# Altium schematic sheet KUBODriver_MCU.SchDoc
size 840 x 594 mm; DocumentNumber: BSV.23-KUBODRIVER Э3; SheetNumber: 4; Format: A1
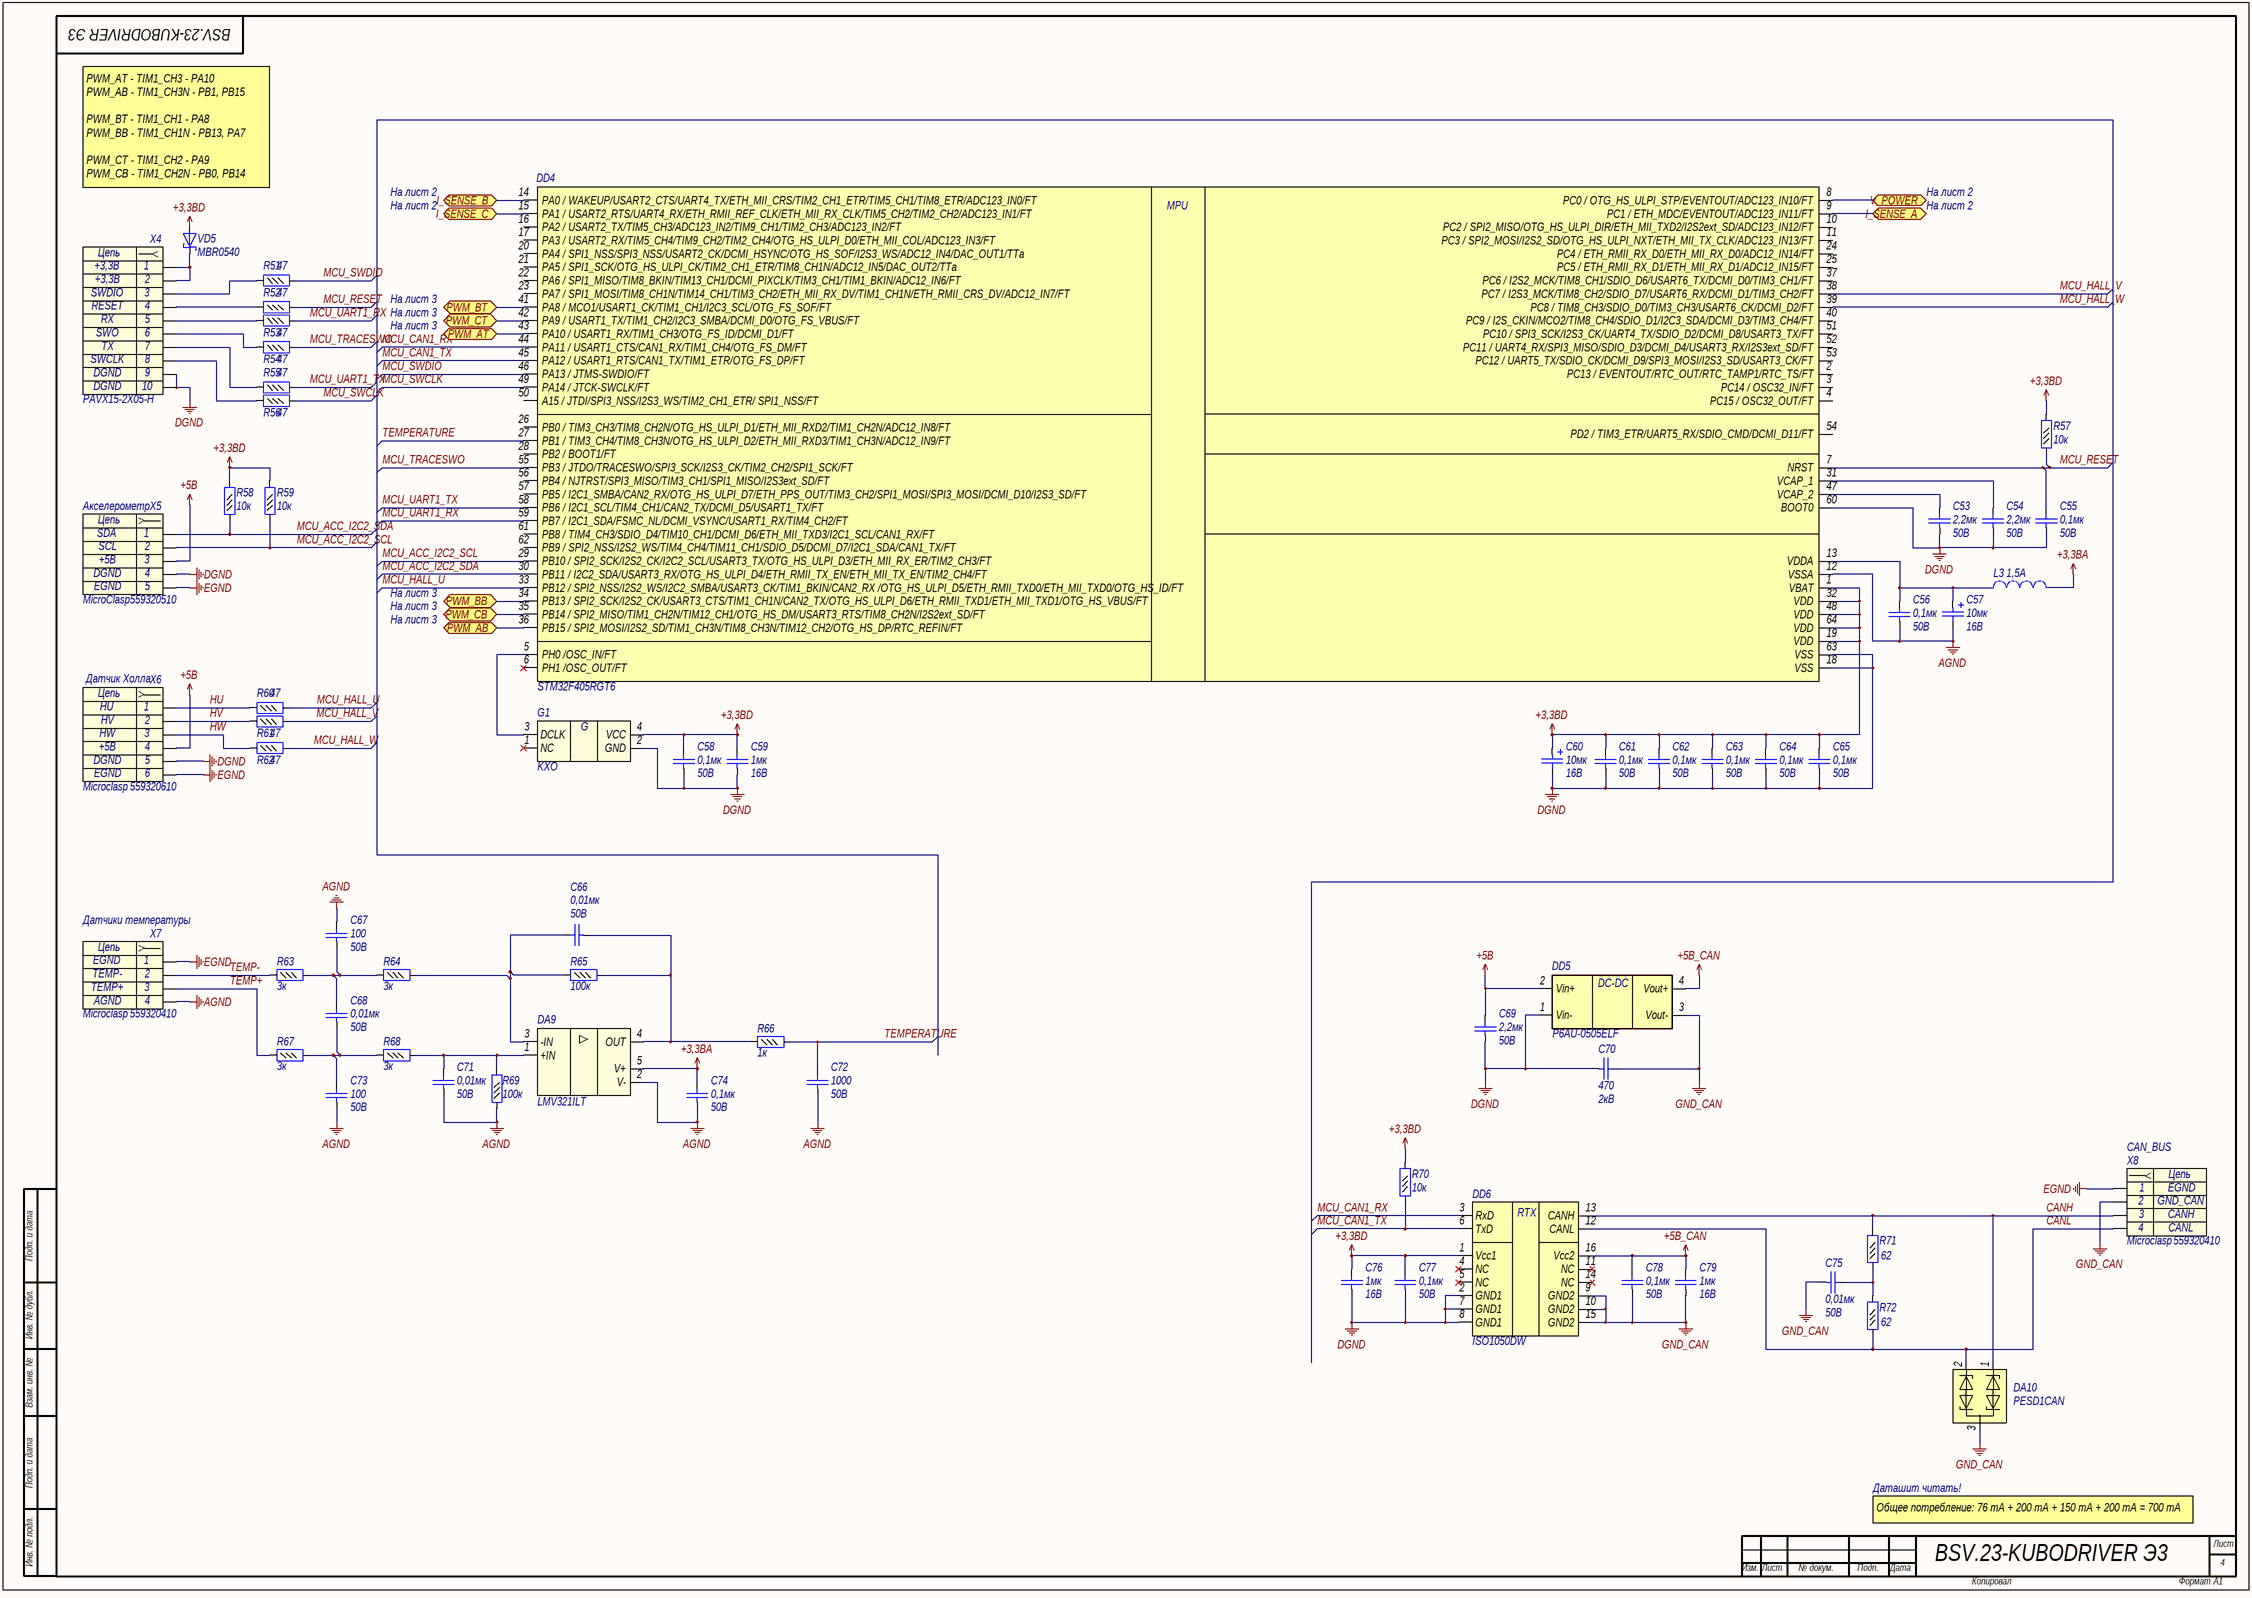
[diagram p0: KUBODriver_MCU.SchDoc]

## Parts
C53  value 2,2мк  Voltage: 50B  [C0603]  (hidden comment: Capacitor)
C54  value 2,2мк  Voltage: 50B  [C0603]  (hidden comment: Capacitor)
C55  value 0,1мк  Voltage: 50В  [C0402]  (hidden comment: Capacitor)
C56  value 0,1мк  Voltage: 50В  [C0402]  (hidden comment: Capacitor)
C57  value 10мк  Voltage: 16В  [TANTAL CASE A]  (hidden comment: Capacitor_pol)
C58  value 0,1мк  Voltage: 50В  [C0402]  (hidden comment: Capacitor)
C59  value 1мк  Voltage: 16B  [C0603]  (hidden comment: Capacitor)
C60  value 10мк  Voltage: 16В  [TANTAL CASE A]  (hidden comment: Capacitor_pol)
C61  value 0,1мк  Voltage: 50В  [C0402]  (hidden comment: Capacitor)
C62  value 0,1мк  Voltage: 50В  [C0402]  (hidden comment: Capacitor)
C63  value 0,1мк  Voltage: 50В  [C0402]  (hidden comment: Capacitor)
C64  value 0,1мк  Voltage: 50В  [C0402]  (hidden comment: Capacitor)
C65  value 0,1мк  Voltage: 50В  [C0402]  (hidden comment: Capacitor)
C66  value 0,01мк  Voltage: 50B  [C0402]  (hidden comment: Capacitor)
C67  value 100  Voltage: 50B  [C0402]  (hidden comment: Capacitor)
C68  value 0,01мк  Voltage: 50B  [C0402]  (hidden comment: Capacitor)
C69  value 2,2мк  Voltage: 50B  [C0603]  (hidden comment: Capacitor)
C70  value 470  Voltage: 2кВ  [C1206]  (hidden comment: Capacitor)
C71  value 0,01мк  Voltage: 50B  [C0402]  (hidden comment: Capacitor)
C72  value 1000  Voltage: 50B  [C0402]  (hidden comment: Capacitor)
C73  value 100  Voltage: 50B  [C0402]  (hidden comment: Capacitor)
C74  value 0,1мк  Voltage: 50В  [C0402]  (hidden comment: Capacitor)
C75  value 0,01мк  Voltage: 50B  [C0402]  (hidden comment: Capacitor)
C76  value 1мк  Voltage: 16B  [C0603]  (hidden comment: Capacitor)
C77  value 0,1мк  Voltage: 50В  [C0402]  (hidden comment: Capacitor)
C78  value 0,1мк  Voltage: 50В  [C0402]  (hidden comment: Capacitor)
C79  value 1мк  Voltage: 16B  [C0603]  (hidden comment: Capacitor)
DA9  LMV321ILT  [SOT23-5]
DA10  Part Number: PESD1CAN  [SOT23-3]  (hidden comment: PESD)
DD4  STM32F405RGT6  [LQFP64]
DD5  Part Number: P6AU-0505ELF  [SIP4]  (hidden comment: P6AU-xxxxELF)
DD6  (no value)  [SO16]
G1  KXO  [QSMD7x5.2x1.8]
L3  Rated Current: 1,5A  [L0603]  (hidden comment: Inductor)
R51  value 47  [R0402]  (hidden comment: Resistor_0,062Вт)
R52  value 47  [R0402]  (hidden comment: Resistor_0,062Вт)
R53  value 47  [R0402]  (hidden comment: Resistor_0,062Вт)
R54  value 47  [R0402]  (hidden comment: Resistor_0,062Вт)
R55  value 47  [R0402]  (hidden comment: Resistor_0,062Вт)
R56  value 47  [R0402]  (hidden comment: Resistor_0,062Вт)
R57  value 10к  [R0402]  (hidden comment: Resistor_0,062Вт)
R58  value 10к  [R0402]  (hidden comment: Resistor_0,062Вт)
R59  value 10к  [R0402]  (hidden comment: Resistor_0,062Вт)
R60  value 47  [R0402]  (hidden comment: Resistor_0,062Вт)
R61  value 47  [R0402]  (hidden comment: Resistor_0,062Вт)
R62  value 47  [R0402]  (hidden comment: Resistor_0,062Вт)
R63  value 3к  [R0402]  (hidden comment: Resistor_0,062Вт)
R64  value 3к  [R0402]  (hidden comment: Resistor_0,062Вт)
R65  value 100к  [R0402]  (hidden comment: Resistor_0,062Вт)
R66  value 1к  [R0402]  (hidden comment: Resistor_0,062Вт)
R67  value 3к  [R0402]  (hidden comment: Resistor_0,062Вт)
R68  value 3к  [R0402]  (hidden comment: Resistor_0,062Вт)
R69  value 100к  [R0402]  (hidden comment: Resistor_0,062Вт)
R70  value 10к  [R0402]  (hidden comment: Resistor_0,062Вт)
R71  value 62  [R0402]  (hidden comment: Resistor_0,062Вт)
R72  value 62  [R0402]  (hidden comment: Resistor_0,062Вт)
VD5  Part Number: MBR0540  [SOD-123]  (hidden comment: DiodeSchottky)
X4  Header_10_sct  [PAVX15-2X05-H]  (value not drawn)
X5  Акселерометр  Part Name: MicroClasp  Part Number: 559320510  [MOLEX_559320510]
X6  Датчик Холла  Part Number: 559320610  [MOLEX_559320610]
X7  Датчики температуры  Part Number: 559320410  [MOLEX_559320410]
X8  CAN_BUS  Part Number: 559320410  [MOLEX_559320410]

## Ports
I_SENSE_A, I_SENSE_B, I_SENSE_C, PWM_AB, PWM_AT, PWM_BB, PWM_BT, PWM_CB, PWM_CT, V_POWER

## Nets
+3,3BA: C74.2 DA9.5(V+) L3.2
+3,3BD: C58.2 C59.2 C60.1 C61.2 C62.2 C63.2 C64.2 C65.2 C76.2 C77.2 DD4.1(VBAT) DD4.19(VDD) DD4.32(VDD) DD4.48(VDD) DD4.64(VDD) DD6.1(Vcc1) G1.4(VCC) R57.2 R58.2 R59.2 R70.2 VD5.2(A)
+5B: C69.2 DD5.2(Vin+) X5.3 X6.4
+5B_CAN: C78.2 C79.2 DD5.4(Vout+) DD6.16(Vcc2)
AGND: C56.1 C57.2 C67.2 C71.1 C72.1 C73.1 C74.1 DA9.2(V-) DD4.12(VSSA) R69.1 X7.4
DGND: C53.1 C54.1 C55.1 C58.1 C59.1 C60.2 C61.1 C62.1 C63.1 C64.1 C65.1 C69.1 C70.1 C76.1 C77.1 DD4.18(VSS) DD4.60(BOOT0) DD4.63(VSS) DD5.1(Vin-) DD6.2(GND1) DD6.7(GND1) DD6.8(GND1) G1.2(GND) X4.9 X4.10 X5.4 X6.5
EGND: X5.5 X6.6 X7.1 X8.1
GND_CAN: C70.2 C75.1 C78.1 C79.1 DA10.3 DD5.3(Vout-) DD6.9(GND2) DD6.10(GND2) DD6.15(GND2) X8.2
CANH: DA10.1 DD6.13(CANH) R71.2 X8.3
CANL: DA10.2 DD6.12(CANL) R72.1 X8.4
HU: R60.1 X6.1
HV: R61.1 X6.2
HW: R62.1 X6.3
I_SENSE_A: DD4.9(PC1_/_ETH_MDC/EVENTOUT/ADC123_IN11/FT) ; port I_SENSE_A
I_SENSE_B: DD4.14(PA0_/_WAKEUP/USART2_CTS/UART4_TX/ETH_MII_CRS/TIM2_CH1_ETR/TIM5_CH1/TIM8_ETR/ADC123_IN0/FT) ; port I_SENSE_B
I_SENSE_C: DD4.15(PA1_/_USART2_RTS/UART4_RX/ETH_RMII_REF_CLK/ETH_MII_RX_CLK/TIM5_CH2/TIM2_CH2/ADC123_IN1/FT) ; port I_SENSE_C
MCU_ACC_I2C2_SCL: DD4.29(PB10_/_SPI2_SCK/I2S2_CK/I2C2_SCL/USART3_TX/OTG_HS_ULPI_D3/ETH_MII_RX_ER/TIM2_CH3/FT) R59.1 X5.2
MCU_ACC_I2C2_SDA: DD4.30(PB11_/_I2C2_SDA/USART3_RX/OTG_HS_ULPI_D4/ETH_RMII_TX_EN/ETH_MII_TX_EN/TIM2_CH4/FT) R58.1 X5.1
MCU_CAN1_RX: DD4.44(PA11_/_USART1_CTS/CAN1_RX/TIM1_CH4/OTG_FS_DM/FT) DD6.3(RxD)
MCU_CAN1_TX: DD4.45(PA12_/_USART1_RTS/CAN1_TX/TIM1_ETR/OTG_FS_DP/FT) DD6.6(TxD) R70.1
MCU_HALL_U: DD4.33(PB12_/_SPI2_NSS/I2S2_WS/I2C2_SMBA/USART3_CK/TIM1_BKIN/CAN2_RX_/OTG_HS_ULPI_D5/ETH_RMII_TXD0/ETH_MII_TXD0/OTG_HS_ID/FT) R60.2
MCU_HALL_V: DD4.38(PC7_/_I2S3_MCK/TIM8_CH2/SDIO_D7/USART6_RX/DCMI_D1/TIM3_CH2/FT) R61.2
MCU_HALL_W: DD4.39(PC8_/_TIM8_CH3/SDIO_D0/TIM3_CH3/USART6_CK/DCMI_D2/FT) R62.2
MCU_RESET: C55.2 DD4.7(NRST) R52.2 R57.1
MCU_SWCLK: DD4.49(PA14_/_JTCK-SWCLK/FT) R56.2
MCU_SWDIO: DD4.46(PA13_/_JTMS-SWDIO/FT) R51.2
MCU_TRACESWO: DD4.55(PB3_/_JTDO/TRACESWO/SPI3_SCK/I2S3_CK/TIM2_CH2/SPI1_SCK/FT) R54.2
MCU_UART1_RX: DD4.59(PB7_/_I2C1_SDA/FSMC_NL/DCMI_VSYNC/USART1_RX/TIM4_CH2/FT) R53.2
MCU_UART1_TX: DD4.58(PB6_/_I2C1_SCL/TIM4_CH1/CAN2_TX/DCMI_D5/USART1_TX/FT) R55.2
PWM_AB: DD4.36(PB15_/_SPI2_MOSI/I2S2_SD/TIM1_CH3N/TIM8_CH3N/TIM12_CH2/OTG_HS_DP/RTC_REFIN/FT) ; port PWM_AB
PWM_AT: DD4.43(PA10_/_USART1_RX/TIM1_CH3/OTG_FS_ID/DCMI_D1/FT) ; port PWM_AT
PWM_BB: DD4.34(PB13_/_SPI2_SCK/I2S2_CK/USART3_CTS/TIM1_CH1N/CAN2_TX/OTG_HS_ULPI_D6/ETH_RMII_TXD1/ETH_MII_TXD1/OTG_HS_VBUS/FT) ; port PWM_BB
PWM_BT: DD4.41(PA8_/_MCO1/USART1_CK/TIM1_CH1/I2C3_SCL/OTG_FS_SOF/FT) ; port PWM_BT
PWM_CB: DD4.35(PB14_/_SPI2_MISO/TIM1_CH2N/TIM12_CH1/OTG_HS_DM/USART3_RTS/TIM8_CH2N/I2S2ext_SD/FT) ; port PWM_CB
PWM_CT: DD4.42(PA9_/_USART1_TX/TIM1_CH2/I2C3_SMBA/DCMI_D0/OTG_FS_VBUS/FT) ; port PWM_CT
TEMP+: R67.1 X7.3
TEMP-: R63.1 X7.2
TEMPERATURE: C72.2 DD4.27(PB1_/_TIM3_CH4/TIM8_CH3N/OTG_HS_ULPI_D2/ETH_MII_RXD3/TIM1_CH3N/ADC12_IN9/FT) R66.2
V_POWER: DD4.8(PC0_/_OTG_HS_ULPI_STP/EVENTOUT/ADC123_IN10/FT) ; port V_POWER
NetC53_2: C53.2 DD4.47(VCAP_2)
NetC54_2: C54.2 DD4.31(VCAP_1)
NetC56_2: C56.2 C57.1 DD4.13(VDDA) L3.1
NetC66_1: C66.1 DA9.4(OUT) R65.2 R66.1
NetC66_2: C66.2 DA9.3(-IN) R64.2 R65.1
NetC67_1: C67.1 C68.2 R63.2 R64.1
NetC68_1: C68.1 C73.2 R67.2 R68.1
NetC71_2: C71.2 DA9.1(+IN) R68.2 R69.2
NetC75_2: C75.2 R71.1 R72.2
NetDD4_5: DD4.5(PH0_/OSC_IN/FT) G1.3(DCLK)
NetR51_1: R51.1 X4.3
NetR52_1: R52.1 X4.4
NetR53_1: R53.1 X4.5
NetR54_1: R54.1 X4.6
NetR55_1: R55.1 X4.7
NetR56_1: R56.1 X4.8
NetVD5_1: VD5.1(K) X4.1 X4.2

Not connected (* = marked no-connect by the designer): DD4 2(PC13_/_EVENTOUT/RTC_OUT/RTC_TAMP1/RTC_TS/FT) 3(PC14_/_OSC32_IN/FT) 4(PC15_/_OSC32_OUT/FT) 6(PH1_/OSC_OUT/FT)* 10(PC2_/_SPI2_MISO/OTG_HS_ULPI_DIR/ETH_MII_TXD2/I2S2ext_SD/ADC123_IN12/FT) 11(PC3_/_SPI2_MOSI/I2S2_SD/OTG_HS_ULPI_NXT/ETH_MII_TX_CLK/ADC123_IN13/FT) 16(PA2_/_USART2_TX/TIM5_CH3/ADC123_IN2/TIM9_CH1/TIM2_CH3/ADC123_IN2/FT) 17(PA3_/_USART2_RX/TIM5_CH4/TIM9_CH2/TIM2_CH4/OTG_HS_ULPI_D0/ETH_MII_COL/ADC123_IN3/FT) 20(PA4_/_SPI1_NSS/SPI3_NSS/USART2_CK/DCMI_HSYNC/OTG_HS_SOF/I2S3_WS/ADC12_IN4/DAC_OUT1/TTa) 21(PA5_/_SPI1_SCK/OTG_HS_ULPI_CK/TIM2_CH1_ETR/TIM8_CH1N/ADC12_IN5/DAC_OUT2/TTa) 22(PA6_/_SPI1_MISO/TIM8_BKIN/TIM13_CH1/DCMI_PIXCLK/TIM3_CH1/TIM1_BKIN/ADC12_IN6/FT) 23(PA7_/_SPI1_MOSI/TIM8_CH1N/TIM14_CH1/TIM3_CH2/ETH_MII_RX_DV/TIM1_CH1N/ETH_RMII_CRS_DV/ADC12_IN7/FT) 24(PC4_/_ETH_RMII_RX_D0/ETH_MII_RX_D0/ADC12_IN14/FT) 25(PC5_/_ETH_RMII_RX_D1/ETH_MII_RX_D1/ADC12_IN15/FT) 26(PB0_/_TIM3_CH3/TIM8_CH2N/OTG_HS_ULPI_D1/ETH_MII_RXD2/TIM1_CH2N/ADC12_IN8/FT) 28(PB2_/_BOOT1/FT) 37(PC6_/_I2S2_MCK/TIM8_CH1/SDIO_D6/USART6_TX/DCMI_D0/TIM3_CH1/FT) 40(PC9_/_I2S_CKIN/MCO2/TIM8_CH4/SDIO_D1/I2C3_SDA/DCMI_D3/TIM3_CH4/FT) 50(A15_/_JTDI/SPI3_NSS/I2S3_WS/TIM2_CH1_ETR/_SPI1_NSS/FT) 51(PC10_/_SPI3_SCK/I2S3_CK/UART4_TX/SDIO_D2/DCMI_D8/USART3_TX/FT) 52(PC11_/_UART4_RX/SPI3_MISO/SDIO_D3/DCMI_D4/USART3_RX/I2S3ext_SD/FT) 53(PC12_/_UART5_TX/SDIO_CK/DCMI_D9/SPI3_MOSI/I2S3_SD/USART3_CK/FT) 54(PD2_/_TIM3_ETR/UART5_RX/SDIO_CMD/DCMI_D11/FT) 56(PB4_/_NJTRST/SPI3_MISO/TIM3_CH1/SPI1_MISO/I2S3ext_SD/FT) 57(PB5_/_I2C1_SMBA/CAN2_RX/OTG_HS_ULPI_D7/ETH_PPS_OUT/TIM3_CH2/SPI1_MOSI/SPI3_MOSI/DCMI_D10/I2S3_SD/FT) 61(PB8_/_TIM4_CH3/SDIO_D4/TIM10_CH1/DCMI_D6/ETH_MII_TXD3/I2C1_SCL/CAN1_RX/FT) 62(PB9_/_SPI2_NSS/I2S2_WS/TIM4_CH4/TIM11_CH1/SDIO_D5/DCMI_D7/I2C1_SDA/CAN1_TX/FT); DD6 4(NC)* 5(NC)* 11(NC)* 14(NC)*; G1 1(NC)*

## Notes on the sheet
- PWM_AT - TIM1_CH3 - PA10
  PWM_AB - TIM1_CH3N - PB1, PB15
  PWM_BT - TIM1_CH1 - PA8
  PWM_BB - TIM1_CH1N - PB13, PA7
  PWM_CT - TIM1_CH2 - PA9
  PWM_CB - TIM1_CH2N - PB0, PB14
- На лист 2
- На лист 3
- (near X6) Microclasp
- (near X7) Microclasp
- Подп. и дата
- (near X8) Microclasp
- Инв. № дубл.
- Взам. инв. №
- Даташит читать!
- Общее потребление: 76 mA + 200 mA + 150 mA + 200 mA = 700 mA
- Инв. № подл.
- Лист
- Изм.
- № докум.
- Подп.
- Дата
- Копировал
- Формат
- (in symbol connect97) Цепь
- (in symbol connect98) Цепь
- (in symbol connect99) Цепь
- (in symbol connect107) Цепь
- (in symbol crystal10) G
- (in symbol interf22) RTX
- (in symbol microcont10) MPU
- (in symbol pwr52) DC-DC

## Library data of the parts
C53 C54 C69 = cap134: Конденсатор; Part Name: Ceramic; Manufacture: Murata; Part Number: GRM188R71A225KE15D; id: cap134; TKE: X7R
C55 C56 C58 C61-C65 C74 C77 C78 = cap277: Конденсатор; Part Name: Ceramic; Manufacture: Murata; Part Number: GRM155R71H104KE14D; id: cap277; TKE: X7R; tga: 0,10%
C57 C60 = cap199: Конденсатор полярный; Part Name: Tantal; Manufacture: Vishay; Part Number: 293D106X9016A2TE3; id: cap199
C59 C76 C79 = cap133: Конденсатор; Part Name: Ceramic; Manufacture: Murata; Part Number: GRM188R71C105KA12D**; id: cap133; TKE: X7R
C66 C68 C71 C75 = cap42: Конденсатор; Part Name: Ceramic; Manufacture: Murata; Part Number: GRM155R71H103K; id: cap42; TKE: X7R
C67 C73 = cap29: Конденсатор; Part Name: Ceramic; Manufacture: Murata; Part Number: GRM1535C1H101J; id: cap29; TKE: NP0
C70 = cap284: Конденсатор; Part Name: Ceramic; Manufacture: Yageo; Part Number: CC1206KKX7RDBB471; id: cap284; TKE: X7R
C72 = cap28: Конденсатор; Part Name: Ceramic; Manufacture: Murata; Part Number: GRM1555C1H102J; id: cap28; TKE: NP0
DA9 = amp10: HIGH-DRIVE OPERATIONAL AMPLIFIERS WITH SHUTDOWN; Part Name: Micropower / Operational Amplifiers; Manufacture: ST Microelectronics; id: amp10; Rail-to-rail: yes; Supply Voltage: 2,7-6B; Supply Current max: 200uA; Bandwidth: 1MHz; Input Bias Current: 10nA; CMRR: 85dB; PSRR: 80dB; Offset voltage: 0,1mB; Channels: 1; Part Number: LMV321ILT
DA10 = PESD1CAN: TVS; Part Name: CAN bus ESD protection diode; Manufacture: Nexperia; id: esd5; Max Reverse Voltage: 24B; Breakdown Voltage: 25,4B; Capacitance: 17pF; Number of Channels: 2
DD4 = microcont10: Part Name: Microcontroller; Frequency: 168MHz; ADC: 16x12b/2x12b; Interface: can, i2c, irda, lin, spi, uart, usbotg,sdio; Flash: 1Mb; Pin in: 51; Power Supply: 1.8-3.6V; id: microcont10; Part Number: STM32F405RGT6
DD5 = pwr52: DC/DC преобразователь; Part Name: DC/DC Converter Isolated; Manufacturer: PEAK Electronics; id: pwr52; Input Voltage: 5B; Current: 200mA; Type: Isolated; Output Voltage: 5B
DD6 = interf22: Isolated CAN Transceiver; Manufacture: Texas Instruments; Number of Channel: 1; Type Supply: Single Polar; Current Consumption: 76mA; Power Supply: 3-5,5В/4,75-5,25В; id: interf22; Part Name: Isolated CAN Transceiver; Part Number: ISO1050DW
G1 = crystal10: Кварц. генер. 32.768 МГц (HCMOS/TTL); Manufacture: GEYER; Part Number: KXO-V97; Frequence: 12MHz; id: crystal10
L3 = ind0: EMI Suppression Filter; Part Name: EMI Suppression Filters; Part Number: BLM18PG181SN1D; id: ind0; Resistance: 0,09Ohm
R51-R56 R60-R62 = res238: Резистор; Manufacture: Yageo; Part Number: RC0402FR-0747RL; id: res238; Accuracy: 0,01; Part Name: Resistor; Power: 0,062Вт
R57-R59 R70 = res294: Резистор; Manufacture: Yageo; Part Number: RC0402FR-0710KL; id: res294; Accuracy: 0,01; Part Name: Resistor; Power: 0,062Вт
R63 R64 R67 R68 = res281: Резистор; Manufacture: Yageo; Part Number: RC0402FR-073KL; id: res281; Accuracy: 0,01; Part Name: Resistor; Power: 0,062Вт
R65 R69 = res318: Резистор; Manufacture: Yageo; Part Number: RC0402FR-07100KL; id: res318; Accuracy: 0,01; Part Name: Resistor; Power: 0,062Вт
R66 = res270: Резистор; Manufacture: Yageo; Part Number: RC0402FR-071KL; id: res270; Accuracy: 0,01; Part Name: Resistor; Power: 0,062Вт
R71 R72 = res241: Резистор; Manufacture: Yageo; Part Number: RC0402FR-0762RL; id: res241; Accuracy: 0,01; Part Name: Resistor; Power: 0,062Вт
VD5 = diode15: Диод Шоттки; Manufacture: ON Semiconductor; Max Reverse Voltage: 40B; Forward Voltage: 0,62B; Forward Current: 0,5А; Capacitance: 30pF; Number of Channels: 1; id: diode15; Part Name: Diode Schottky
X4 = connect107: Разъем - 10 конт. розетка; Part Name: Штыри двухрядные 2x5; Manufacture: Auk Contractors; Contact_1: +3,3B; Contact_3: SWDIO; Contact_4: RESET; Contact_5: RX; Contact_6: SWO; Etch: 1.27mm; Contact_7: TX; Contact_8: SWCLK; Contact_9: DGND; Contact_2: +3,3B; id: connect107; Part Number: PAVX15-2X05-H; Contact_10: DGND
X5 = connect98: Разъем - 5 конт. розетка; Manufacture: Molex; Contact_1: SDA; Contact_2: SCL; Contact_3: +5B; Contact_4: DGND; Contact_5: EGND; Etch: 2mm; id: connect98
X6 = connect99: Разъем - 6 конт. розетка; Part Name: MicroClasp; Manufacture: Molex; Contact_1: HU; Contact_2: HV; Contact_3: HW; Contact_4: +5B; Contact_5: DGND; Contact_6: EGND; Etch: 2mm; id: connect99
X7 = connect97: Разъем - 4 конт. розетка; Part Name: MicroClasp Wire-to-Board Header; Manufacture: Molex; Contact_1: EGND; Contact_2: TEMP-; Contact_3: TEMP+; Contact_4: AGND; Etch: 2mm; id: connect97
X8 = connect97: Разъем - 4 конт. розетка; Part Name: MicroClasp Wire-to-Board Header; Manufacture: Molex; Contact_1: EGND; Contact_2: GND_CAN; Contact_3: CANH; Contact_4: CANL; Etch: 2mm; id: connect97